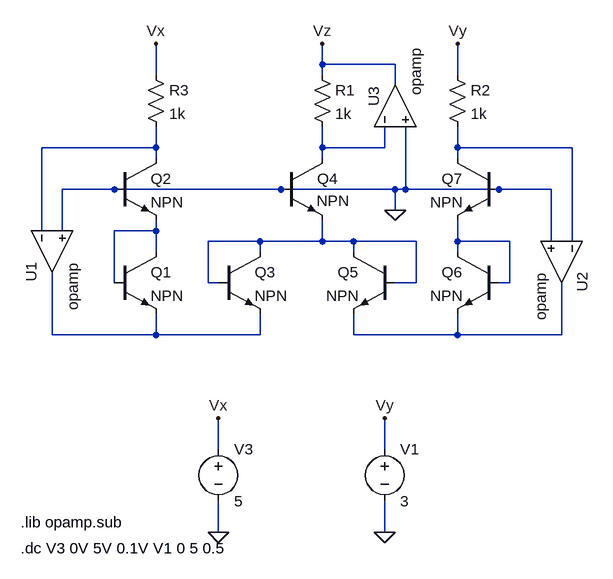
[diagram p0: schematic Draft1.asc]
Draft1.asc, the LTspice schematic file:
Version 4
SHEET 1 1040 680
WIRE 384 -240 384 -272
WIRE 496 -240 384 -240
WIRE 128 -224 128 -272
WIRE 384 -224 384 -240
WIRE 592 -224 592 -272
WIRE 496 -208 496 -240
WIRE 128 -112 128 -144
WIRE 128 -112 -48 -112
WIRE 384 -112 384 -144
WIRE 480 -112 480 -144
WIRE 480 -112 384 -112
WIRE 592 -112 592 -144
WIRE 768 -112 592 -112
WIRE 128 -96 128 -112
WIRE 384 -96 384 -112
WIRE 592 -96 592 -112
WIRE 64 -48 -16 -48
WIRE 320 -48 64 -48
WIRE 496 -48 320 -48
WIRE 512 -48 512 -144
WIRE 512 -48 496 -48
WIRE 656 -48 512 -48
WIRE 736 -48 656 -48
WIRE 496 -16 496 -48
WIRE -48 16 -48 -112
WIRE -16 16 -16 -48
WIRE 128 16 128 0
WIRE 128 16 64 16
WIRE 288 32 208 32
WIRE 384 32 384 0
WIRE 384 32 288 32
WIRE 432 32 384 32
WIRE 528 32 432 32
WIRE 592 32 592 0
WIRE 672 32 592 32
WIRE 736 32 736 -48
WIRE 768 32 768 -112
WIRE 128 48 128 16
WIRE 288 48 288 32
WIRE 432 48 432 32
WIRE 592 48 592 32
WIRE 64 96 64 16
WIRE 208 96 208 32
WIRE 224 96 208 96
WIRE 528 96 528 32
WIRE 528 96 496 96
WIRE 672 96 672 32
WIRE 672 96 656 96
WIRE -32 176 -32 80
WIRE 128 176 128 144
WIRE 128 176 -32 176
WIRE 288 176 288 144
WIRE 288 176 128 176
WIRE 432 176 432 144
WIRE 592 176 592 144
WIRE 592 176 432 176
WIRE 752 176 752 96
WIRE 752 176 592 176
WIRE 224 352 224 304
WIRE 480 352 480 304
WIRE 224 480 224 432
WIRE 480 480 480 432
FLAG 496 -16 0
FLAG 384 -272 Vz
FLAG 128 -272 Vx
FLAG 224 304 Vx
FLAG 480 304 Vy
FLAG 592 -272 Vy
FLAG 224 480 0
FLAG 480 480 0
SYMBOL npn 64 48 R0
SYMATTR InstName Q1
SYMBOL npn 64 -96 R0
SYMATTR InstName Q2
SYMBOL npn 224 48 R0
SYMATTR InstName Q3
SYMBOL npn 320 -96 R0
WINDOW 3 55 66 Left 2
SYMATTR InstName Q4
SYMBOL npn 496 48 M0
SYMATTR InstName Q5
SYMBOL npn 656 48 M0
SYMATTR InstName Q6
SYMBOL npn 656 -96 M0
SYMATTR InstName Q7
SYMBOL Opamps\\opamp -96 48 M90
SYMATTR InstName U1
SYMBOL Opamps\\opamp 816 64 R90
SYMATTR InstName U2
SYMBOL Opamps\\opamp 432 -176 R270
WINDOW 0 -1 31 Left 2
SYMATTR InstName U3
SYMBOL res 368 -240 R0
SYMATTR InstName R1
SYMATTR Value 1k
SYMBOL res 576 -240 R0
SYMATTR InstName R2
SYMATTR Value 1k
SYMBOL res 112 -240 R0
SYMATTR InstName R3
SYMATTR Value 1k
SYMBOL voltage 480 336 R0
WINDOW 123 0 0 Left 2
WINDOW 39 0 0 Left 2
SYMATTR InstName V1
SYMATTR Value 3
SYMBOL voltage 224 336 R0
WINDOW 123 0 0 Left 2
WINDOW 39 0 0 Left 2
SYMATTR InstName V3
SYMATTR Value 5
TEXT -80 504 Left 2 !.dc V3 0V 5V 0.1V V1 0 5 0.5
TEXT -80 464 Left 2 !.lib opamp.sub

The netlist it stands for:
* Draft1.asc
Q1 N004 N004 N007 0 NPN
Q2 N001 0 N004 0 NPN
Q3 N005 N005 N007 0 NPN
Q4 N002 0 N005 0 NPN
Q5 N005 N005 N008 0 NPN
Q6 N006 N006 N008 0 NPN
Q7 N003 0 N006 0 NPN
XU1 N001 0 N007 opamp Aol=100K GBW=10Meg  ; pins invin noninvin out
XU2 N003 0 N008 opamp Aol=100K GBW=10Meg  ; pins invin noninvin out
XU3 N002 0 Vz opamp Aol=100K GBW=10Meg  ; pins invin noninvin out
R1 Vz N002 1k
R2 Vy N003 1k
R3 Vx N001 1k
V1 Vy 0 3
V3 Vx 0 5
.model NPN NPN
.model PNP PNP
.lib standard.bjt
.dc V3 0V 5V 0.1V V1 0 5 0.5
.lib opamp.sub
.backanno
.end

* Results of the author's LTspice run, read from the files saved beside the schematic
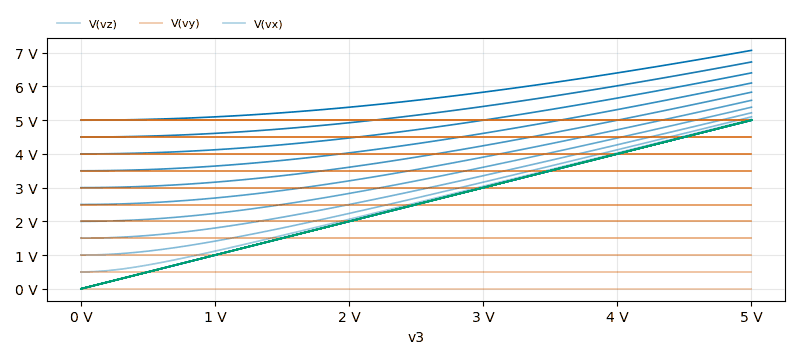
[diagram p1: DC transfer characteristic of Draft1.asc, plotted from the saved traces]
* DC transfer characteristic, 11 runs:
*   V(vz) [run 1]: 0 V at v3=0 V, 5 V at v3=5 V, min 0 V, max 5 V
*   V(vz) [run 2]: 500 mV at v3=0 V, 5.025 V at v3=5 V, min 500 mV, max 5.025 V
*   V(vz) [run 3]: 1 V at v3=0 V, 5.099 V at v3=5 V, min 1 V, max 5.099 V
*   V(vz) [run 4]: 1.5 V at v3=0 V, 5.22 V at v3=5 V, min 1.5 V, max 5.22 V
*   V(vz) [run 5]: 2 V at v3=0 V, 5.385 V at v3=5 V, min 2 V, max 5.385 V
*   V(vz) [run 6]: 2.5 V at v3=0 V, 5.59 V at v3=5 V, min 2.5 V, max 5.59 V
*   V(vz) [run 7]: 3 V at v3=0 V, 5.831 V at v3=5 V, min 3 V, max 5.831 V
*   V(vz) [run 8]: 3.5 V at v3=0 V, 6.103 V at v3=5 V, min 3.5 V, max 6.103 V
*   V(vy) [run 1]: 0 V at v3=0 V, 0 V at v3=5 V, min 0 V, max 0 V
*   V(vy) [run 2]: 500 mV at v3=0 V, 500 mV at v3=5 V, min 500 mV, max 500 mV
*   V(vy) [run 3]: 1 V at v3=0 V, 1 V at v3=5 V, min 1 V, max 1 V
*   V(vy) [run 4]: 1.5 V at v3=0 V, 1.5 V at v3=5 V, min 1.5 V, max 1.5 V
*   V(vy) [run 5]: 2 V at v3=0 V, 2 V at v3=5 V, min 2 V, max 2 V
*   V(vy) [run 6]: 2.5 V at v3=0 V, 2.5 V at v3=5 V, min 2.5 V, max 2.5 V
*   V(vy) [run 7]: 3 V at v3=0 V, 3 V at v3=5 V, min 3 V, max 3 V
*   V(vy) [run 8]: 3.5 V at v3=0 V, 3.5 V at v3=5 V, min 3.5 V, max 3.5 V
*   V(vx) [run 1]: 0 V at v3=0 V, 5 V at v3=5 V, min 0 V, max 5 V
*   V(vx) [run 2]: 0 V at v3=0 V, 5 V at v3=5 V, min 0 V, max 5 V
*   V(vx) [run 3]: 0 V at v3=0 V, 5 V at v3=5 V, min 0 V, max 5 V
*   V(vx) [run 4]: 0 V at v3=0 V, 5 V at v3=5 V, min 0 V, max 5 V
*   V(vx) [run 5]: 0 V at v3=0 V, 5 V at v3=5 V, min 0 V, max 5 V
*   V(vx) [run 6]: 0 V at v3=0 V, 5 V at v3=5 V, min 0 V, max 5 V
*   V(vx) [run 7]: 0 V at v3=0 V, 5 V at v3=5 V, min 0 V, max 5 V
*   V(vx) [run 8]: 0 V at v3=0 V, 5 V at v3=5 V, min 0 V, max 5 V